# EAGLE design AST1020 (EAGLE 6.3)
DATABASE: ./../../../../../Components/TinyCircuits_Part_Database.txt

## Sheet 1 of 2
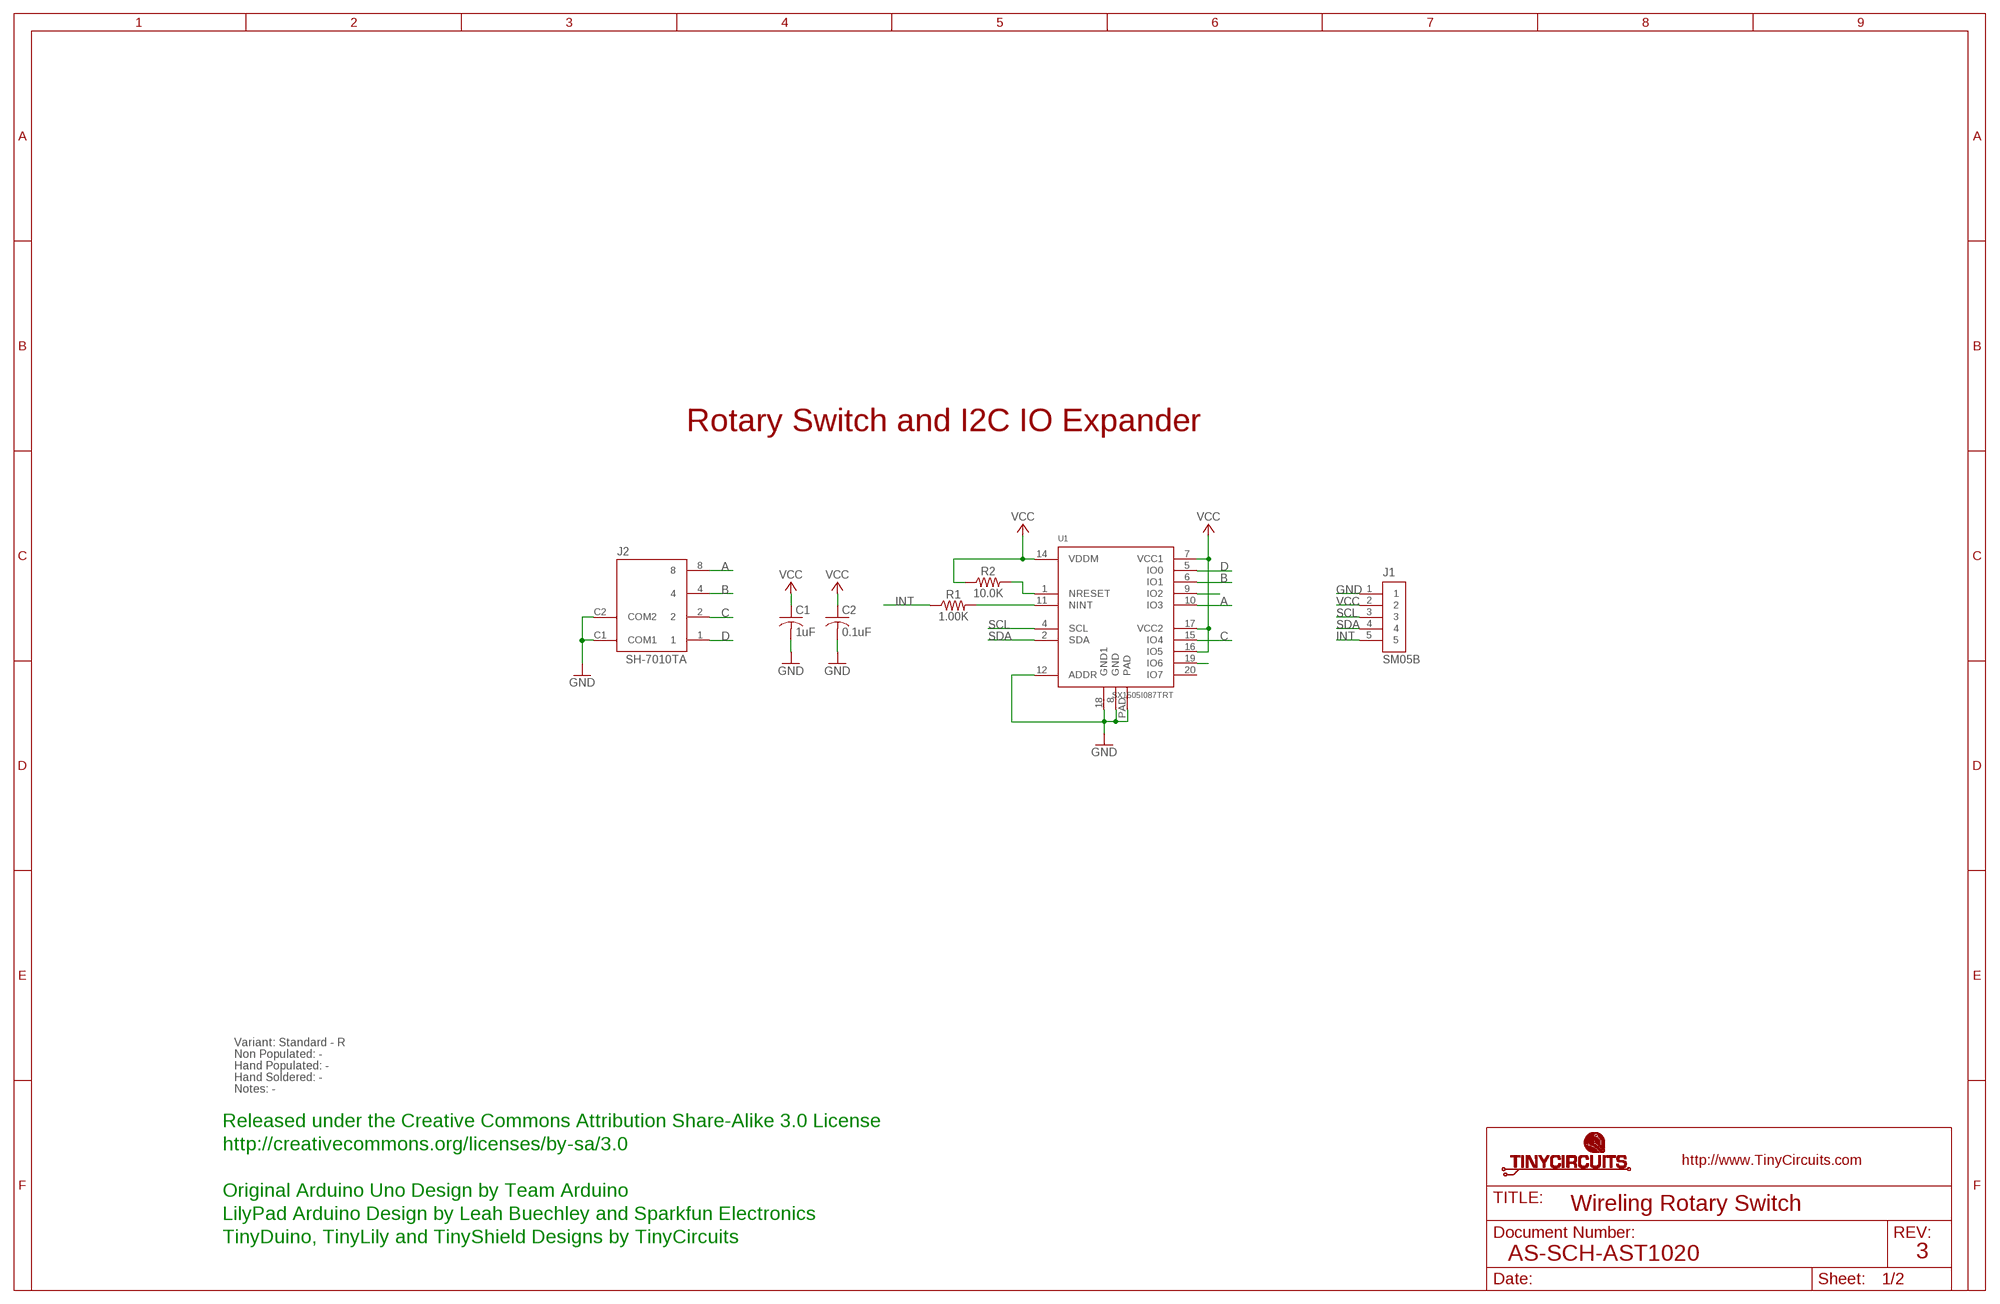
[diagram p0: schematic, sheet 1]

### Parts
C1  1uF  AS-ITM-00105  [C0402]
C2  0.1uF  AS-ITM-00008  [C0402]
J1  SM05B  AS-ITM-00340EDGE  [JST_SH_5X1_EDGE]
J2  SH-7010TA  AS-ITM-00295  [SH-7000]
R1  1.00K  AS-ITM-00003  [0402]
R2  10.0K  AS-ITM-00032  [0402]
U1  SX1505I087TRT  AS-ITM-00203  [QFN-UT20]

### Nets
A: J2.8 U1.10(IO3)
B: J2.4 U1.6(IO1)
C: J2.2 U1.15(IO4)
D: J2.1 U1.5(IO0)
GND: C1.2 C2.2 J1.1 J2.C1(COM1) J2.C2(COM2) U1.8(GND) U1.12(ADDR) U1.18(GND1) U1.PAD
INT: J1.5 R1.1
N$1: U1.9(IO2)
N$5: U1.19(IO6)
N$21: R1.2 U1.11(NINT)
N$22: R2.2 U1.1(NRESET)
SCL: J1.3 U1.4(SCL)
SDA: J1.4 U1.2(SDA)
VCC: C1.1 C2.1 J1.2 R2.1 U1.7(VCC1) U1.14(VDDM) U1.16(IO5) U1.17(VCC2)
Unconnected: U1.20(IO7)

### Notes on the sheet
- Rotary Switch and I2C IO Expander
- Variant: Standard - R
- Non Populated: -
- Hand Populated: -
- Hand Soldered: -
- Notes: -
- Released under the Creative Commons Attribution Share-Alike 3.0 License
- http://creativecommons.org/licenses/by-sa/3.0
- Original Arduino Uno Design by Team Arduino
- Wireling Rotary Switch
- LilyPad Arduino Design by Leah Buechley and Sparkfun Electronics
- TinyDuino, TinyLily and TinyShield Designs by TinyCircuits
- AS-SCH-AST1020 | 3

## Sheet 2 of 2
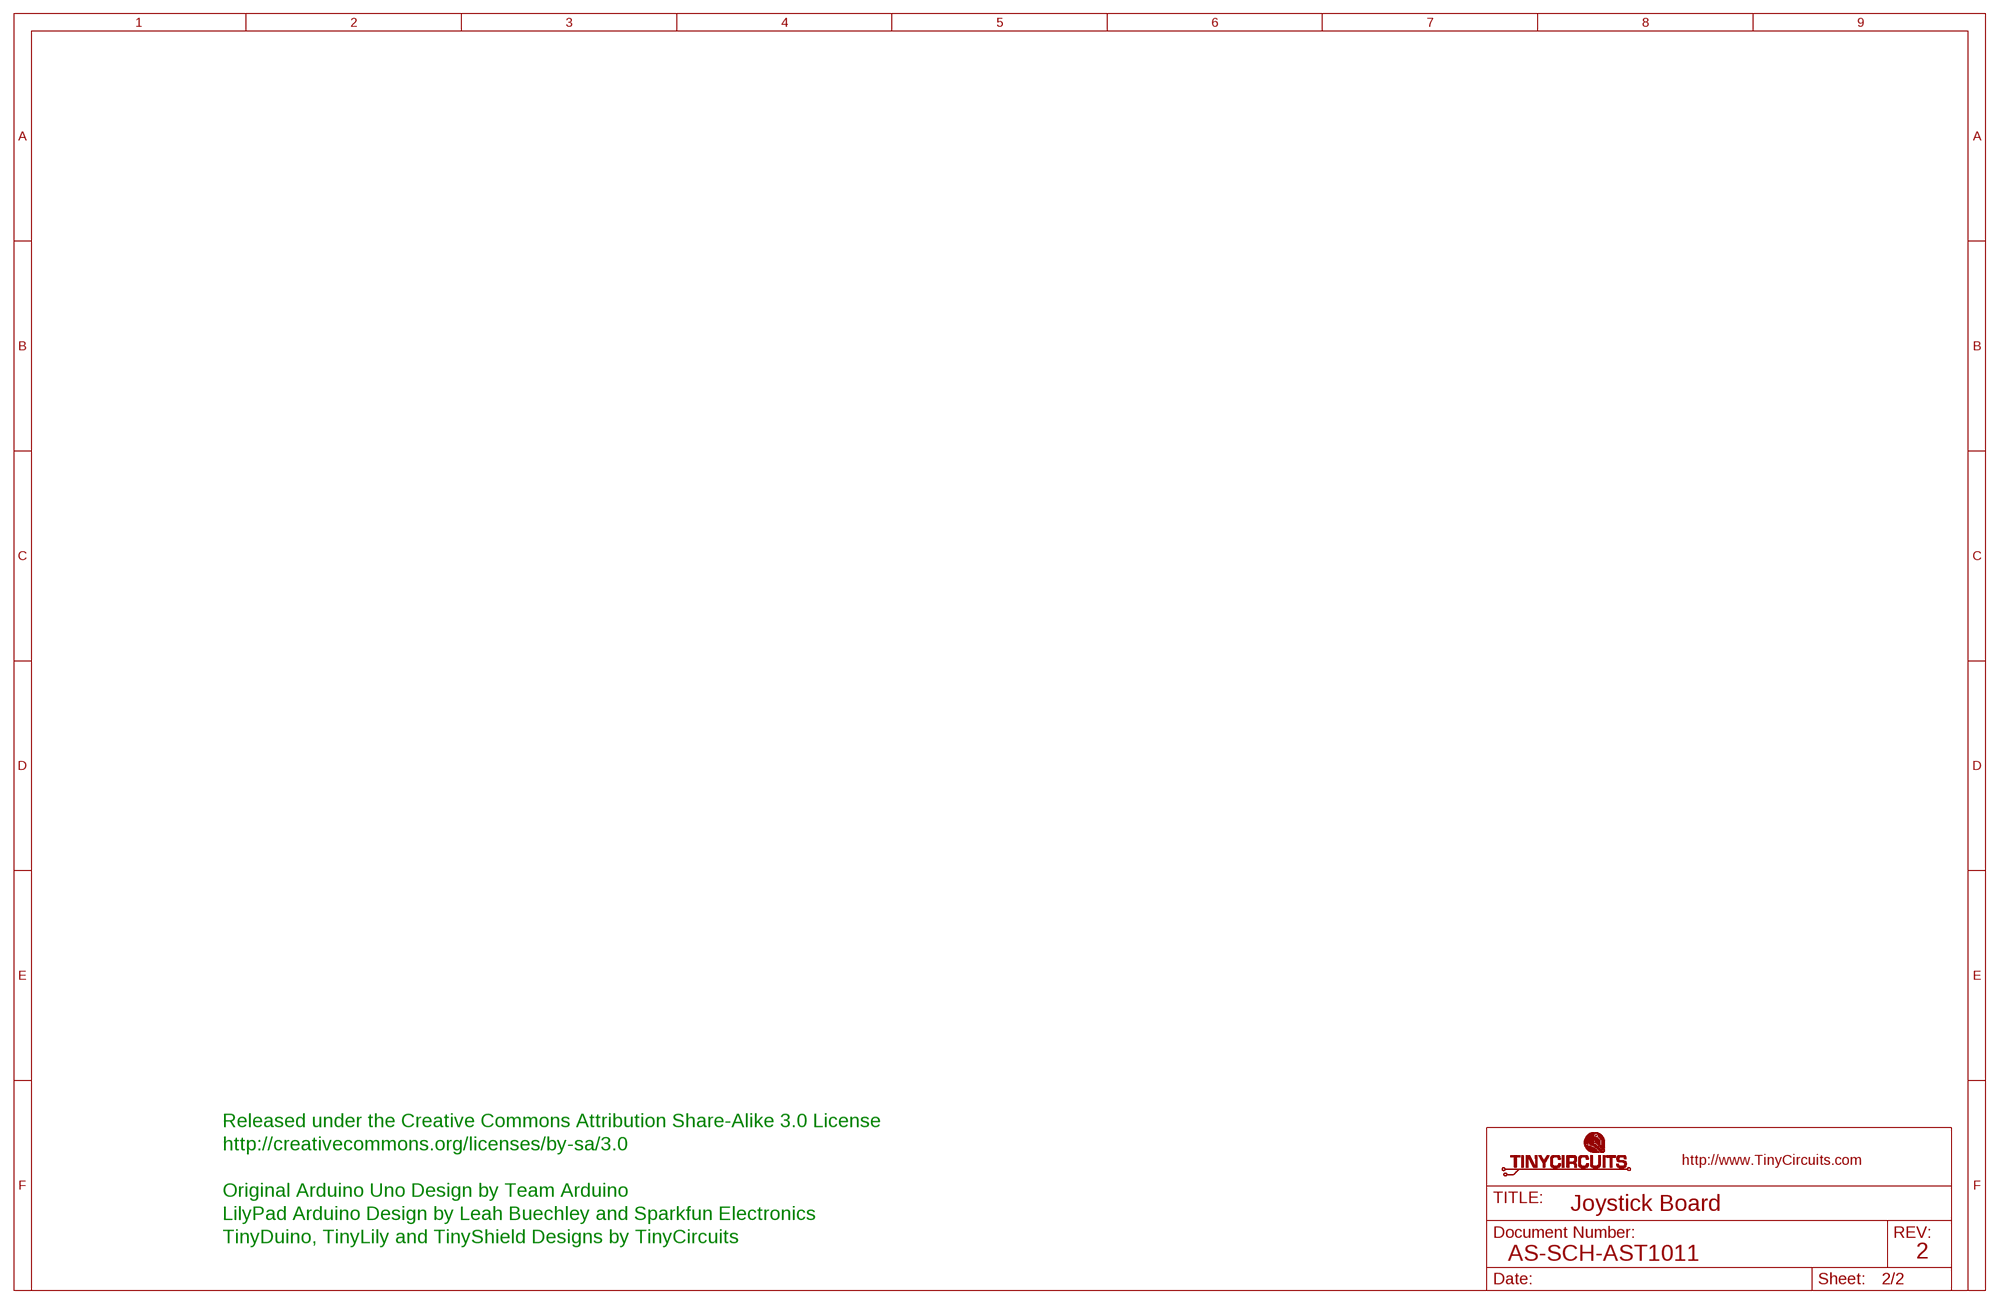
[diagram p1: schematic, sheet 2]

### Notes on the sheet
- Released under the Creative Commons Attribution Share-Alike 3.0 License
- http://creativecommons.org/licenses/by-sa/3.0
- Original Arduino Uno Design by Team Arduino
- Joystick Board
- LilyPad Arduino Design by Leah Buechley and Sparkfun Electronics
- TinyDuino, TinyLily and TinyShield Designs by TinyCircuits
- AS-SCH-AST1011 | 2

## Library data of the parts
C1 = tinycircuits:AS-ITM-00105: CAP CER 1UF 6.3V 10% X5R 0402; PARTNO: AS-ITM-00105
C2 = tinycircuits:AS-ITM-00008: CAP CER 0.1UF 16V 10% X5R 0402; PARTNO: AS-ITM-00008
J1 = tinycircuits:AS-ITM-00340: CONN HEADER SH 5POS SIDE 1MM TIN; PARTNO: AS-ITM-00340; PNPROTATION: 180
J2 = tinycircuits:AS-ITM-00295: SWITCH ROTARY BCD 10POS SMD 5V; PARTNO: AS-ITM-00295; PNPROTATION: 0
R1 = tinycircuits:AS-ITM-00003: RES 1.00K OHM 1/16W 1% 0402; PARTNO: AS-ITM-00003
R2 = tinycircuits:AS-ITM-00032: RES 10.0K OHM 1/16W 1% 0402 SMD; PARTNO: AS-ITM-00032
U1 = tinycircuits:AS-ITM-00203: IC GPIO EXP I2C 8CH 20UTQFN; PARTNO: AS-ITM-00203

## Net classes
2 gnd: width 0.305 mm, drill 0.559 mm, clearance 0.254 mm

## Board
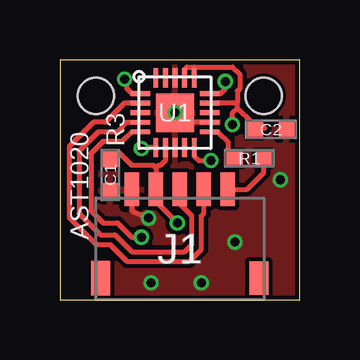
[diagram p2: board, top side]
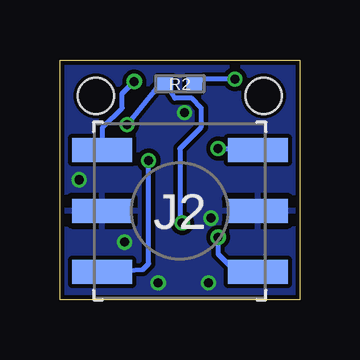
[diagram p3: board, bottom side, seen from below]

Size 10 x 10 mm. Coordinates in mm from the lower left corner, seen from the top.
Outline: 0,0 10,0 10,10 0,10 0,0
Copper layers (1*16): Top 0.035mm / dielectric 1.5mm / Bottom 0.035mm
Design rules "default *": minimum track width 8mil, minimum drill 15mil, track to track 7mil, track to pad 7mil, pad to pad 7mil, via to via 7mil, smd to smd 7mil, copper to edge 7mil, drill to drill 8mil, minimum pad ring 8mil, minimum via ring 5mil, stop-mask expansion 4mil, vias tented up to drill 25mil, thermal gap 10mil
Holes 1.5 mm at 1.5,8.5 8.5,8.5

### Footprints (pad centres in the part's own frame; a part is rotated, then mirrored left to right if it is on the bottom)
C0402 = smd 0.65 x 0.6: 1 -0.65,0; 2 0.65,0
JST_SH_5X1_EDGE = smd 0.6 x 1.4: 1 -2,2.475; 2 -1,2.475; 3 0,2.475; 4 1,2.475; 5 2,2.475 | smd 0.8 x 1.4: PAD1 -3.3,-1.225; PAD2 3.3,-1.225
SH-7000 = smd 2.5 x 1: 1 3.25,-2.54; 2 -3.25,2.54; 4 3.25,2.54; 8 -3.25,-2.54; C1 -3.25,0; C2 3.25,0
0402 = smd 0.65 x 0.55: 1 -0.6,0; 2 0.6,0
QFN-UT20 = smd 0.8 x 0.2: 1 -1.45,0.8; 2 -1.45,0.4; 3 -1.45,0; 4 -1.45,-0.4; 5 -1.45,-0.8; 11 1.45,-0.8; 12 1.45,-0.4; 13 1.45,0; 14 1.45,0.4; 15 1.45,0.8 | smd 0.2 x 0.8: 6 -0.8,-1.45; 7 -0.4,-1.45; 8 0,-1.45; 9 0.4,-1.45; 10 0.8,-1.45; 16 0.8,1.45; 17 0.4,1.45; 18 0,1.45; 19 -0.4,1.45; 20 -0.8,1.45 | smd 1.6 x 1.6: PAD 0,0

### Placement (x,y rotation side)
C1  2.1,5.2 270 top
C2  8.8,7.1 0 top
J1  5,2.12 0 top
J2  5,3.7 0 bottom
R1  7.9,5.9 180 top
R2  5,9 0 bottom
U1  4.8,7.8 0 top
U$1  [DOCFIELD-TINYCIRCUITS-PCB]  19,-10 0 top  (outside the outline)

### Tracks (layer width: path | path; a pad name or v marks a point on that pad's centre or on a via)
A  (via drill 0.38)
  Top 0.203: U1.10 5.6,6 5.8,5.8 v6.3,5.8
  Bottom 0.203: J2.8 6.54,1.26 6.3,1.5 v6.3,5.8
B  (via drill 0.38)
  Top 0.203: U1.6 3.45,6.35 v3.4,6.3
  Bottom 0.203: v3.4,6.3 1.79,6.3 J2.4
C  (via drill 0.38)
  Top 0.203: U1.15 6.7,8.6 6.9,8.8 v6.9,9.1
  Bottom 0.203: J2.2 8.21,6.3 8.21,7.19 7.4,8 7.4,8.6 v6.9,9.1
D  (via drill 0.38)
  Top 0.203: v3.4,2.6 3,2.6 2.4,3.2 1.8,3.2 1.3,3.7 1.3,6.1 1.8,6.6 2.6,6.6 3,7 U1.5
  Bottom 0.203: v3.4,2.6 3.4,1.9 2.8,1.3 1.79,1.3 J2.1
GND  (via drill 0.38)
  Top 0.203: U1.12 5.3,7.4 U1.PAD | J1.1 3,3.7 v3.7,3.4
  other vias: 4.8,7.8 9.2,5 5.9,0.7 7.3,2.4 3.8,0.7
  pour Bottom: 0,10 10,10 10,0 0,0
  pour Top: 0,10 10,10 10,0 0,0
INT
  Top 0.203: J1.5 7.8,4.6 8.5,5.3 R1.1
N$21
  Top 0.203: U1.11 6.6,7 7,6.6 7,6.2 R1.2
N$22  (via drill 0.38)
  Top 0.203: U1.1 3,8.6 2.8,8.8 2.8,9.1 v2.7,9.2
  Bottom 0.203: v2.7,9.2 4,9.2 R2.2
SCL
  Top 0.203: U1.4 2.8,7.4 2.4,7 1.6,7 0.8,6.2 0.8,3.6 1.7,2.7 2.3,2.7 3,2 5.2,2 5.5,2.3 5.5,3.5 5,4 J1.3
SDA
  Top 0.203: U1.2 2.7,8.2 1.9,7.4 1.4,7.4 0.4,6.4 0.4,3.4 1.5,2.3 2.1,2.3 2.8,1.6 5.4,1.6 5.9,2.1 5.9,3.5 6,3.6 J1.4
VCC  (via drill 0.38)
  Top 0.203: U1.17 5.2,9.6 5.3,9.7 5.6,9.7 | U1.16 5.6,9.7 | 5.6,9.7 7.2,9.7 7.5,9.4 7.5,8.8 7.4,8.7 7.4,8.2 | 7.4,8.2 U1.14 | U1.7 4.4,5.8 4.2,5.6 4.1,5.6 4,5.5 | 4,5.5 3.9,5.6 3,5.6 2.5,6.1 2.05,6.1 C1.1 | 7.4,8 7.4,8.2 | v4.9,3.2 4,4.1 J1.2 4,5.5 | 7.4,8 8,7.4 8.3,7.4 8.55,7.15 C2.1 | v7.2,7.3 7.2,7.8 7.4,8
  Bottom 0.203: v4.9,3.2 5,3.3 5,6.3 4.1,7.2 4.1,8 4.5,8.4 5.2,8.4 R2.1 6,8.8 v7.2,7.3

### Text on the board
tPlace: R3 | AST1020
Document: FABRICATION DRAWING | NOTES: | 1. PRINTED CIRCUIT BOARD MADE FROM NEMA GRADE FR-4 EPOXY LAMINATE | WITH 1 OUNCE COPPER PLATING AND .024 THICKNESS. | 2. ALL DIMENSIONS ARE GIVEN IN MILLIMETERS. | 3. CIRCUIT PATHS ARE FOR REFERENCE ONLY. | 4. HOLE SIZES SHOWN ARE FINISHED DIAMETERS AFTER PLATING. | 5. BOARD PLATED USING REFLOW OR SIMILAR METHOD. | 6. BOARD TO HAVE BLUE SOLDER MASK ON PLATED SURFACES USING WET FILM | 7. SILKSCREEN BOARD USING WHITE INK. | SR100 OR SR1010 EPOXY. EQUIVALENT WET OR DRY FILM MAY BE USED. | 8. THE FOLLOWING INFORMATION APPLIES TO THIS BOARD: | * 2 COPPER LAYERS | * .024 BOARD THICKNESS | * REQUIRES TOP SIDE SILKSCREEN | Released under the Creative Commons Attribution Share-Alike 3.0 License | http://creativecommons.org/licenses/by-sa/3.0 | Original Arduino Uno Design by Team Arduino | LilyPad Arduino Design by Leah Buechley and Sparkfun Electronics | TinyDuino, TinyLily and TinyShield Designs by TinyCircuits | Wireling Rotary Switch | AS-PCB-AST1020 | 3